# Altium project MiniPC.PrjPcb (part 4 of 17)

## Sheet 2XSFP_Arria10.SchDoc: 2 x SFP
size B; DocumentNumber: 18; SheetNumber: 18; SheetTotal: 46
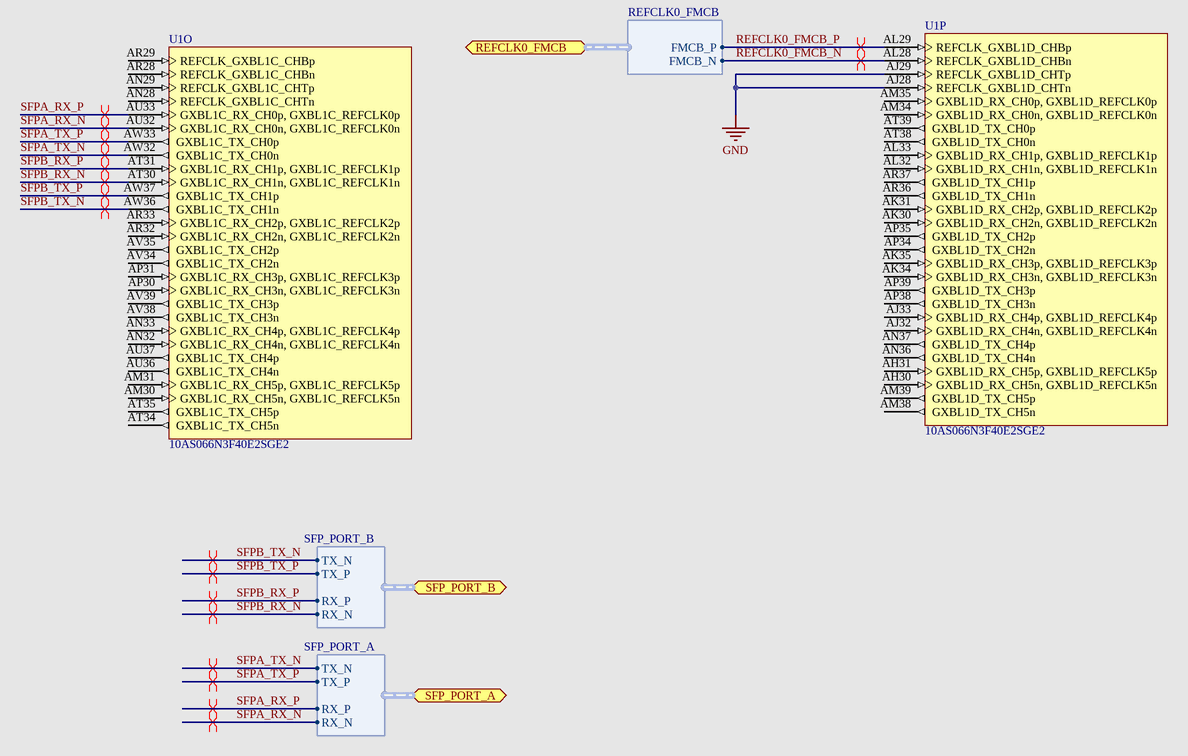
[diagram p17: 2XSFP_Arria10.SchDoc]

### Parts
U1  10AS066N3F40E2SGE2  [ALTR-FBGA1517_A-350]  (parts O,P of 31)

### Ports
REFCLK0_FMCB (harness REFCLK0_FMCB), SFP_PORT_A (harness SFP_PORT_A), SFP_PORT_B (harness SFP_PORT_B)

### Harnesses
REFCLK0_FMCB: FMCB_P, FMCB_N
SFP_PORT_B: TX_P, TX_N, RX_P, RX_N
SFP_PORT_A: TX_P, TX_N, RX_P, RX_N

### Nets
GND: U1.AJ28(REFCLK_GXBL1D_CHTn) U1.AJ29(REFCLK_GXBL1D_CHTp)
REFCLK0_FMCB_N: U1.AL28(REFCLK_GXBL1D_CHBn) ; port REFCLK0_FMCB.FMCB_N
REFCLK0_FMCB_P: U1.AL29(REFCLK_GXBL1D_CHBp) ; port REFCLK0_FMCB.FMCB_P
SFPA_RX_N: U1.AU32(GXBL1C_RX_CH0n,_GXBL1C_REFCLK0n) ; port SFP_PORT_A.RX_N
SFPA_RX_P: U1.AU33(GXBL1C_RX_CH0p,_GXBL1C_REFCLK0p) ; port SFP_PORT_A.RX_P
SFPA_TX_N: U1.AW32(GXBL1C_TX_CH0n) ; port SFP_PORT_A.TX_N
SFPA_TX_P: U1.AW33(GXBL1C_TX_CH0p) ; port SFP_PORT_A.TX_P
SFPB_RX_N: U1.AT30(GXBL1C_RX_CH1n,_GXBL1C_REFCLK1n) ; port SFP_PORT_B.RX_N
SFPB_RX_P: U1.AT31(GXBL1C_RX_CH1p,_GXBL1C_REFCLK1p) ; port SFP_PORT_B.RX_P
SFPB_TX_N: U1.AW36(GXBL1C_TX_CH1n) ; port SFP_PORT_B.TX_N
SFPB_TX_P: U1.AW37(GXBL1C_TX_CH1p) ; port SFP_PORT_B.TX_P

Not connected (* = marked no-connect by the designer): U1 AH30(GXBL1D_RX_CH5n,_GXBL1D_REFCLK5n) AH31(GXBL1D_RX_CH5p,_GXBL1D_REFCLK5p) AJ32(GXBL1D_RX_CH4n,_GXBL1D_REFCLK4n) AJ33(GXBL1D_RX_CH4p,_GXBL1D_REFCLK4p) AK30(GXBL1D_RX_CH2n,_GXBL1D_REFCLK2n) AK31(GXBL1D_RX_CH2p,_GXBL1D_REFCLK2p) AK34(GXBL1D_RX_CH3n,_GXBL1D_REFCLK3n) AK35(GXBL1D_RX_CH3p,_GXBL1D_REFCLK3p) AL32(GXBL1D_RX_CH1n,_GXBL1D_REFCLK1n) AL33(GXBL1D_RX_CH1p,_GXBL1D_REFCLK1p) AM30(GXBL1C_RX_CH5n,_GXBL1C_REFCLK5n) AM31(GXBL1C_RX_CH5p,_GXBL1C_REFCLK5p) AM34(GXBL1D_RX_CH0n,_GXBL1D_REFCLK0n) AM35(GXBL1D_RX_CH0p,_GXBL1D_REFCLK0p) AM38(GXBL1D_TX_CH5n) AM39(GXBL1D_TX_CH5p) AN28(REFCLK_GXBL1C_CHTn) AN29(REFCLK_GXBL1C_CHTp) AN32(GXBL1C_RX_CH4n,_GXBL1C_REFCLK4n) AN33(GXBL1C_RX_CH4p,_GXBL1C_REFCLK4p) AN36(GXBL1D_TX_CH4n) AN37(GXBL1D_TX_CH4p) AP30(GXBL1C_RX_CH3n,_GXBL1C_REFCLK3n) AP31(GXBL1C_RX_CH3p,_GXBL1C_REFCLK3p) AP34(GXBL1D_TX_CH2n) AP35(GXBL1D_TX_CH2p) AP38(GXBL1D_TX_CH3n) AP39(GXBL1D_TX_CH3p) AR28(REFCLK_GXBL1C_CHBn) AR29(REFCLK_GXBL1C_CHBp) AR32(GXBL1C_RX_CH2n,_GXBL1C_REFCLK2n) AR33(GXBL1C_RX_CH2p,_GXBL1C_REFCLK2p) AR36(GXBL1D_TX_CH1n) AR37(GXBL1D_TX_CH1p) AT34(GXBL1C_TX_CH5n) AT35(GXBL1C_TX_CH5p) AT38(GXBL1D_TX_CH0n) AT39(GXBL1D_TX_CH0p) AU36(GXBL1C_TX_CH4n) AU37(GXBL1C_TX_CH4p) AV34(GXBL1C_TX_CH2n) AV35(GXBL1C_TX_CH2p) AV38(GXBL1C_TX_CH3n) AV39(GXBL1C_TX_CH3p)

### Layout directives
differential pair: REFCLK0_FMCB_N, REFCLK0_FMCB_P, SFPA_RX_N, SFPA_RX_P, SFPA_TX_N, SFPA_TX_P, SFPB_RX_N, SFPB_RX_P, SFPB_TX_N, SFPB_TX_P

### Notes on the sheet
- Title
- Size:
- Date:
- B
- Number:
- Time:
- Revision:
- Sheet
- of
- File:

### Library data of the parts
U1 = CMP-1689-00006-3: as U1 on sheet DDR4_Arria10; ComponentLink3Description: Package Specification; PackageVersion: Rev. 5.0, 01/2016; ComponentLink3URL: https://www.altera.com/content/dam/altera-www/global/en_US/pdfs/literature/packaging/04r00461-04.pdf; ComponentLink2Description: Datasheet; Code_JEDEC: MS-034; Mounting Technology: Surface Mount; PartNumber: 10AS066N3F40E2SGE2; PackageDescription: 1517-Pin FineLine Ball-Grid Array (FBGA), Body 40 x 40 mm, Pitch 1 mm; ComponentLink2URL: https://www.altera.com/content/dam/altera-www/global/en_US/pdfs/literature/hb/arria-10/a10_datasheet.pdf; ComponentLink1URL: https://www.altera.com/; DatasheetVersion: Rev. 2016-06-24, 06/2016; ComponentLink1Description: Manufacturer URL

## Sheet HPS1_Arria10.SchDoc: HPS Dedicated IOs
size B; DocumentNumber: 26; SheetNumber: 26; SheetTotal: 46
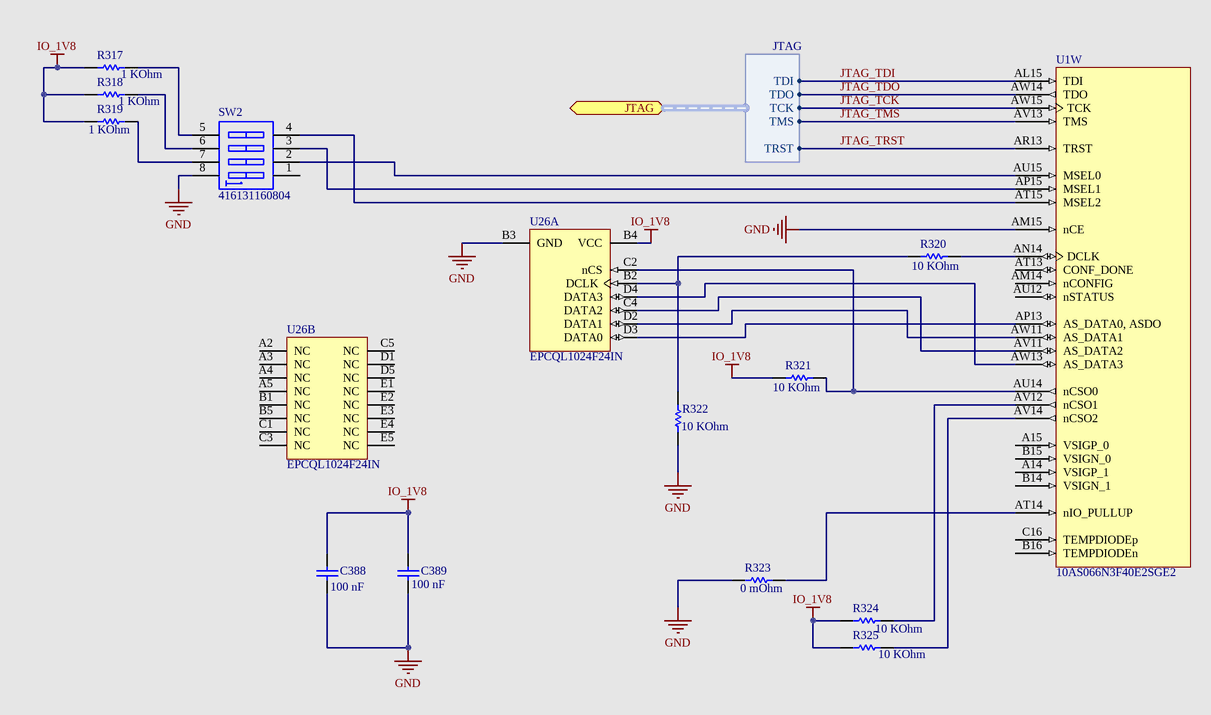
[diagram p18: HPS1_Arria10.SchDoc]

### Parts
(Parts that share a designator on the sheet are numbered #1, #2 ... from top to bottom, then left to right.)
C388  Capacitance: 100 nF  [CAPC1005X55X10LL05]  (hidden comment: C1005X7R1E104M)
C389  Capacitance: 100 nF  [CAPC1005X55X10LL05]  (hidden comment: C1005X7R1E104M)
R317  Resistance: 1 KOhm  [RESC1005X40X25LL05T05]  (hidden comment: ERJ-2RKF1001X)
R318  Resistance: 1 KOhm  [RESC1005X40X25LL05T05]  (hidden comment: ERJ-2RKF1001X)
R319  Resistance: 1 KOhm  [RESC1005X40X25LL05T05]  (hidden comment: ERJ-2RKF1001X)
R320  Resistance: 10 KOhm  [RESC1005X40X25NL05T05]  (hidden comment: ERJ-2RKF1002X)
R321  Resistance: 10 KOhm  [RESC1005X40X25NL05T05]  (hidden comment: ERJ-2RKF1002X)
R322  Resistance: 10 KOhm  [RESC1005X40X25NL05T05]  (hidden comment: ERJ-2RKF1002X)
R323  Resistance: 0 mOhm  [RESC1005X40X25ML05T05]  (hidden comment: ERJ-2GE0R00X)
R324  Resistance: 10 KOhm  [RESC1005X40X25NL05T05]  (hidden comment: ERJ-2RKF1002X)
R325  Resistance: 10 KOhm  [RESC1005X40X25NL05T05]  (hidden comment: ERJ-2RKF1002X)
SW2  416131160804  [416131160804]
U1  10AS066N3F40E2SGE2  [ALTR-FBGA1517_A-350]  (part W of 31)
U26#1  EPCQL1024F24IN  [ALTR-FBGA24_A-130]  (part B of 2)
U26#2  EPCQL1024F24IN  [ALTR-FBGA24_A-130]  (part A of 2)

### Ports
JTAG (harness JTAG)

### Harnesses
JTAG: TDI, TDO, TCK, TMS, TRST

### Nets
GND: C388.1 C389.1 R322.1 R323.1 SW2.8 U1.AM15(nCE) U26#2.B3(GND)
IO_1V8: C388.2 C389.2 R317.1 R318.1 R319.1 R321.1 R324.1 R325.1 U26#2.B4(VCC)
JTAG_TCK: U1.AW15(TCK) ; port JTAG.TCK
JTAG_TDI: U1.AL15(TDI) ; port JTAG.TDI
JTAG_TDO: U1.AW14(TDO) ; port JTAG.TDO
JTAG_TMS: U1.AV13(TMS) ; port JTAG.TMS
JTAG_TRST: U1.AR13(TRST) ; port JTAG.TRST
NetR317_2: R317.2 SW2.5
NetR318_2: R318.2 SW2.6
NetR319_2: R319.2 SW2.7
NetR320_1: R320.1 R322.2 U26#2.B2(DCLK)
NetR320_2: R320.2 U1.AN14(DCLK)
NetR321_2: R321.2 U1.AU14(nCSO0) U26#2.C2(nCS)
NetR323_2: R323.2 U1.AT14(nIO_PULLUP)
NetR324_2: R324.2 U1.AV12(nCSO1)
NetR325_2: R325.2 U1.AV14(nCSO2)
NetSW2_2: SW2.2 U1.AU15(MSEL0)
NetSW2_3: SW2.3 U1.AP15(MSEL1)
NetSW2_4: SW2.4 U1.AT15(MSEL2)
NetU1_AP13: U1.AP13(AS_DATA0,_ASDO) U26#2.D3(DATA0)
NetU1_AV11: U1.AV11(AS_DATA2) U26#2.C4(DATA2)
NetU1_AW11: U1.AW11(AS_DATA1) U26#2.D2(DATA1)
NetU1_AW13: U1.AW13(AS_DATA3) U26#2.D4(DATA3)

Not connected (* = marked no-connect by the designer): SW2 1; U1 A14(VSIGP_1) A15(VSIGP_0) AM14(nCONFIG) AT13(CONF_DONE) AU12(nSTATUS) B14(VSIGN_1) B15(VSIGN_0) B16(TEMPDIODEn) C16(TEMPDIODEp); U26#1 A2(NC) A3(NC) A4(NC) A5(NC) B1(NC) B5(NC) C1(NC) C3(NC) C5(NC) D1(NC) D5(NC) E1(NC) E2(NC) E3(NC) E4(NC) E5(NC)

### Notes on the sheet
- Title
- Size:
- Date:
- B
- Number:
- Time:
- Revision:
- Sheet
- of
- File:

### Library data of the parts
C388 C389 = CMP-1663-00009-2: Chip Capacitor, 0.1 uF, +/- 20%, 25 V, -55 to 125 degC, 0402 (1005 Metric), RoHS, Tape and Reel; Type (Capacitors): X7R; Voltage Rating: 25 V; Case\/Package: 0402; Tolerance: 20%; Mounting Technology: Surface Mount; Max Operating Temperature: 125 degC; ComponentLink2URL: http://www.farnell.com/datasheets/1571323.pdf; ComponentLink1URL: http://www.tdk.com/; RoHSCompliant: true; Packaging: Tape and Reel; ComponentLink2Description: Datasheet; Case Code (Imperial): 0402; DatasheetVersion: 09/2011; ComponentLink1Description: Manufacturer URL; PackageDescription: 2-Pin Surface Mount Device, Body 1 x 0.5 mm; PackageReference: 0402; Min Operating Temperature: -55 degC; Case Code (Metric): 1005; Height: 0.5 mm; Package Quantity: 10000; Width: 0.5 mm; Pins: 2; Voltage Rating (DC): 25 V; PartNumber: C1005X7R1E104M; Mount: Surface Mount; Length: 1 mm
R317-R319 = CMP-2002-00606-3: Chip Resistor, 1 KOhm, +/- 1%, 100 mW, -55 to 155 degC, 0402 (1005 Metric), RoHS, Tape and Reel; Manufacturer: Basic Passives; Voltage Rating: 50 V; Power Rating: 100 mW; Case\/Package: 0402; PartNumber: ERJ-2RKF1001X; Width: 0.5 mm; ComponentLink1URL: http://www.panasonic.com/; Length: 1 mm; Min Operating Temperature: -55 degC; PackageDescription: 2-Pin Surface Mount Device, Body 1 x 0.5 mm; Case Code (Metric): 1005; Height: 0.35 mm; ComponentLink1Description: Manufacturer URL; Mounting Technology: Surface Mount; Tolerance: 1%; Packaging: Tape and Reel; Package Quantity: 10000; REACH SVHC: Yes; Max Operating Temperature: 155 degC; Mount: Surface Mount; RoHSCompliant: true; Case Code (Imperial): 0402; DatasheetVersion: 04/2015; Radiation Hardening: No; Pins: 2; ComponentLink2Description: Datasheet; PackageReference: 0402; ComponentLink2URL: http://industrial.panasonic.com/cdbs/www-data/pdf/RDA0000/AOA0000C86.pdf
R320-R322 R324 R325 = CMP-2002-00607-3: Chip Resistor, 10 KOhm, +/- 1%, 100 mW, -55 to 155 degC, 0402 (1005 Metric), RoHS, Tape and Reel; Manufacturer: Basic Passives; Voltage Rating: 50 V; Power Rating: 100 mW; Case\/Package: 0402; Case Code (Imperial): 0402; Min Operating Temperature: -55 degC; PartNumber: ERJ-2RKF1002X; Mounting Technology: Surface Mount; Length: 1 mm; Packaging: Tape and Reel; ComponentLink1Description: Manufacturer URL; Mount: Surface Mount; Package Quantity: 10000; Max Operating Temperature: 155 degC; Case Code (Metric): 1005; Height: 0.35 mm; ComponentLink1URL: http://www.panasonic.com/; Tolerance: 1%; REACH SVHC: Yes; RoHSCompliant: true; Width: 0.5 mm; PackageDescription: 2-Pin Surface Mount Device, Body 1 x 0.5 mm; Radiation Hardening: No; PackageReference: 0402; ComponentLink2Description: Datasheet; DatasheetVersion: 04/2015; ComponentLink2URL: http://industrial.panasonic.com/cdbs/www-data/pdf/RDA0000/AOA0000C86.pdf; Pins: 2
R323 = CMP-2002-00429-3: Chip Resistor, 0 mOhm, +/- 5%, 100 mW, -55 to 155 degC, 0402 (1005 Metric), RoHS, Tape and Reel; Manufacturer: Basic Passives; Power Rating: 100 mW; Voltage Rating: 50 V; Case\/Package: 0402; Max Operating Temperature: 155 degC; Tolerance: 5%; PartNumber: ERJ-2GE0R00X; Case Code (Imperial): 0402; Package Quantity: 10000; Length: 1 mm; Mounting Technology: Surface Mount; ComponentLink1URL: http://www.panasonic.com/; Height: 0.35 mm; Width: 0.5 mm; Min Operating Temperature: -55 degC; Case Code (Metric): 1005; RoHSCompliant: true; REACH SVHC: Unknown; ComponentLink1Description: Manufacturer URL; Packaging: Tape and Reel; Mount: Surface Mount; PackageDescription: 2-Pin Surface Mount Device, Body 1 x 0.5 mm; PackageReference: 0402; ComponentLink2URL: http://industrial.panasonic.com/cdbs/www-data/pdf/RDA0000/AOA0000C84.pdf; DatasheetVersion: 03/2015; Radiation Hardening: No; Pins: 2; ComponentLink2Description: Datasheet
SW2 = CMP-1433-00004-1: WS-DISV 1.27 mm small compact SMD Dip Switch with top tape; Manufacturer: Wuerth Elektronik; NoPins: 08; ComponentLink2URL: http://katalog.we-online.de/em/datasheet/4161311608xx.pdf; PackageReference: 416131160804; ComponentLink1URL: http://www.we-online.com; ComponentLink2Description: Datasheet; PartNumber: 416131160804; ComponentLink1Description: Manufacturer URL
U1 = CMP-1689-00006-3: as U1 on sheet DDR4_Arria10; ComponentLink3Description: Package Specification; PackageVersion: Rev. 5.0, 01/2016; ComponentLink3URL: https://www.altera.com/content/dam/altera-www/global/en_US/pdfs/literature/packaging/04r00461-04.pdf; ComponentLink2Description: Datasheet; Code_JEDEC: MS-034; Mounting Technology: Surface Mount; PartNumber: 10AS066N3F40E2SGE2; PackageDescription: 1517-Pin FineLine Ball-Grid Array (FBGA), Body 40 x 40 mm, Pitch 1 mm; ComponentLink2URL: https://www.altera.com/content/dam/altera-www/global/en_US/pdfs/literature/hb/arria-10/a10_datasheet.pdf; ComponentLink1URL: https://www.altera.com/; DatasheetVersion: Rev. 2016-06-24, 06/2016; ComponentLink1Description: Manufacturer URL
U26#1 U26#2 = CMP-1689-00001-1: EPCQ-L Serial Configuration Device, 1.8 V, -40 to 85 degC, 24-Pin FBGA, RoHS, Tray; Manufacturer: Altera; ComponentLink1URL: https://www.altera.com/; PackageVersion: Rev. 2.0, 01/2015; ComponentLink2Description: Datasheet; PackageDescription: 24-Pin FineLine Ball-Grid Array, Body 6 x 8 mm, Pitch 1 mm; ComponentLink1Description: Manufacturer URL; PartNumber: EPCQL1024F24IN; ComponentLink3URL: https://www.altera.com/content/dam/altera-www/global/en_US/pdfs/literature/packaging/04r00469-01.pdf; PackageReference: FBGA24_A-130; ComponentLink3Description: Package Specification; DatasheetVersion: Rev. 2016-05-30; ComponentLink2URL: https://www.altera.com/content/dam/altera-www/global/en_US/pdfs/literature/hb/cfg/cfg_cf52013.pdf; Mounting Technology: Surface Mount; PartId: 1